# EasyEDA Pro project ProProject_myXBoxGamepad_2024-06-05.epro, schematic Schematic1_1
Create Date: 2024-04-02; Page Name: P1; Project Name: myXBoxGamepad; Schematic Name: Schematic1_1; Update Date: 2024-04-14; Company: 嘉立创EDA; Page Size: A4; Version: V1.0
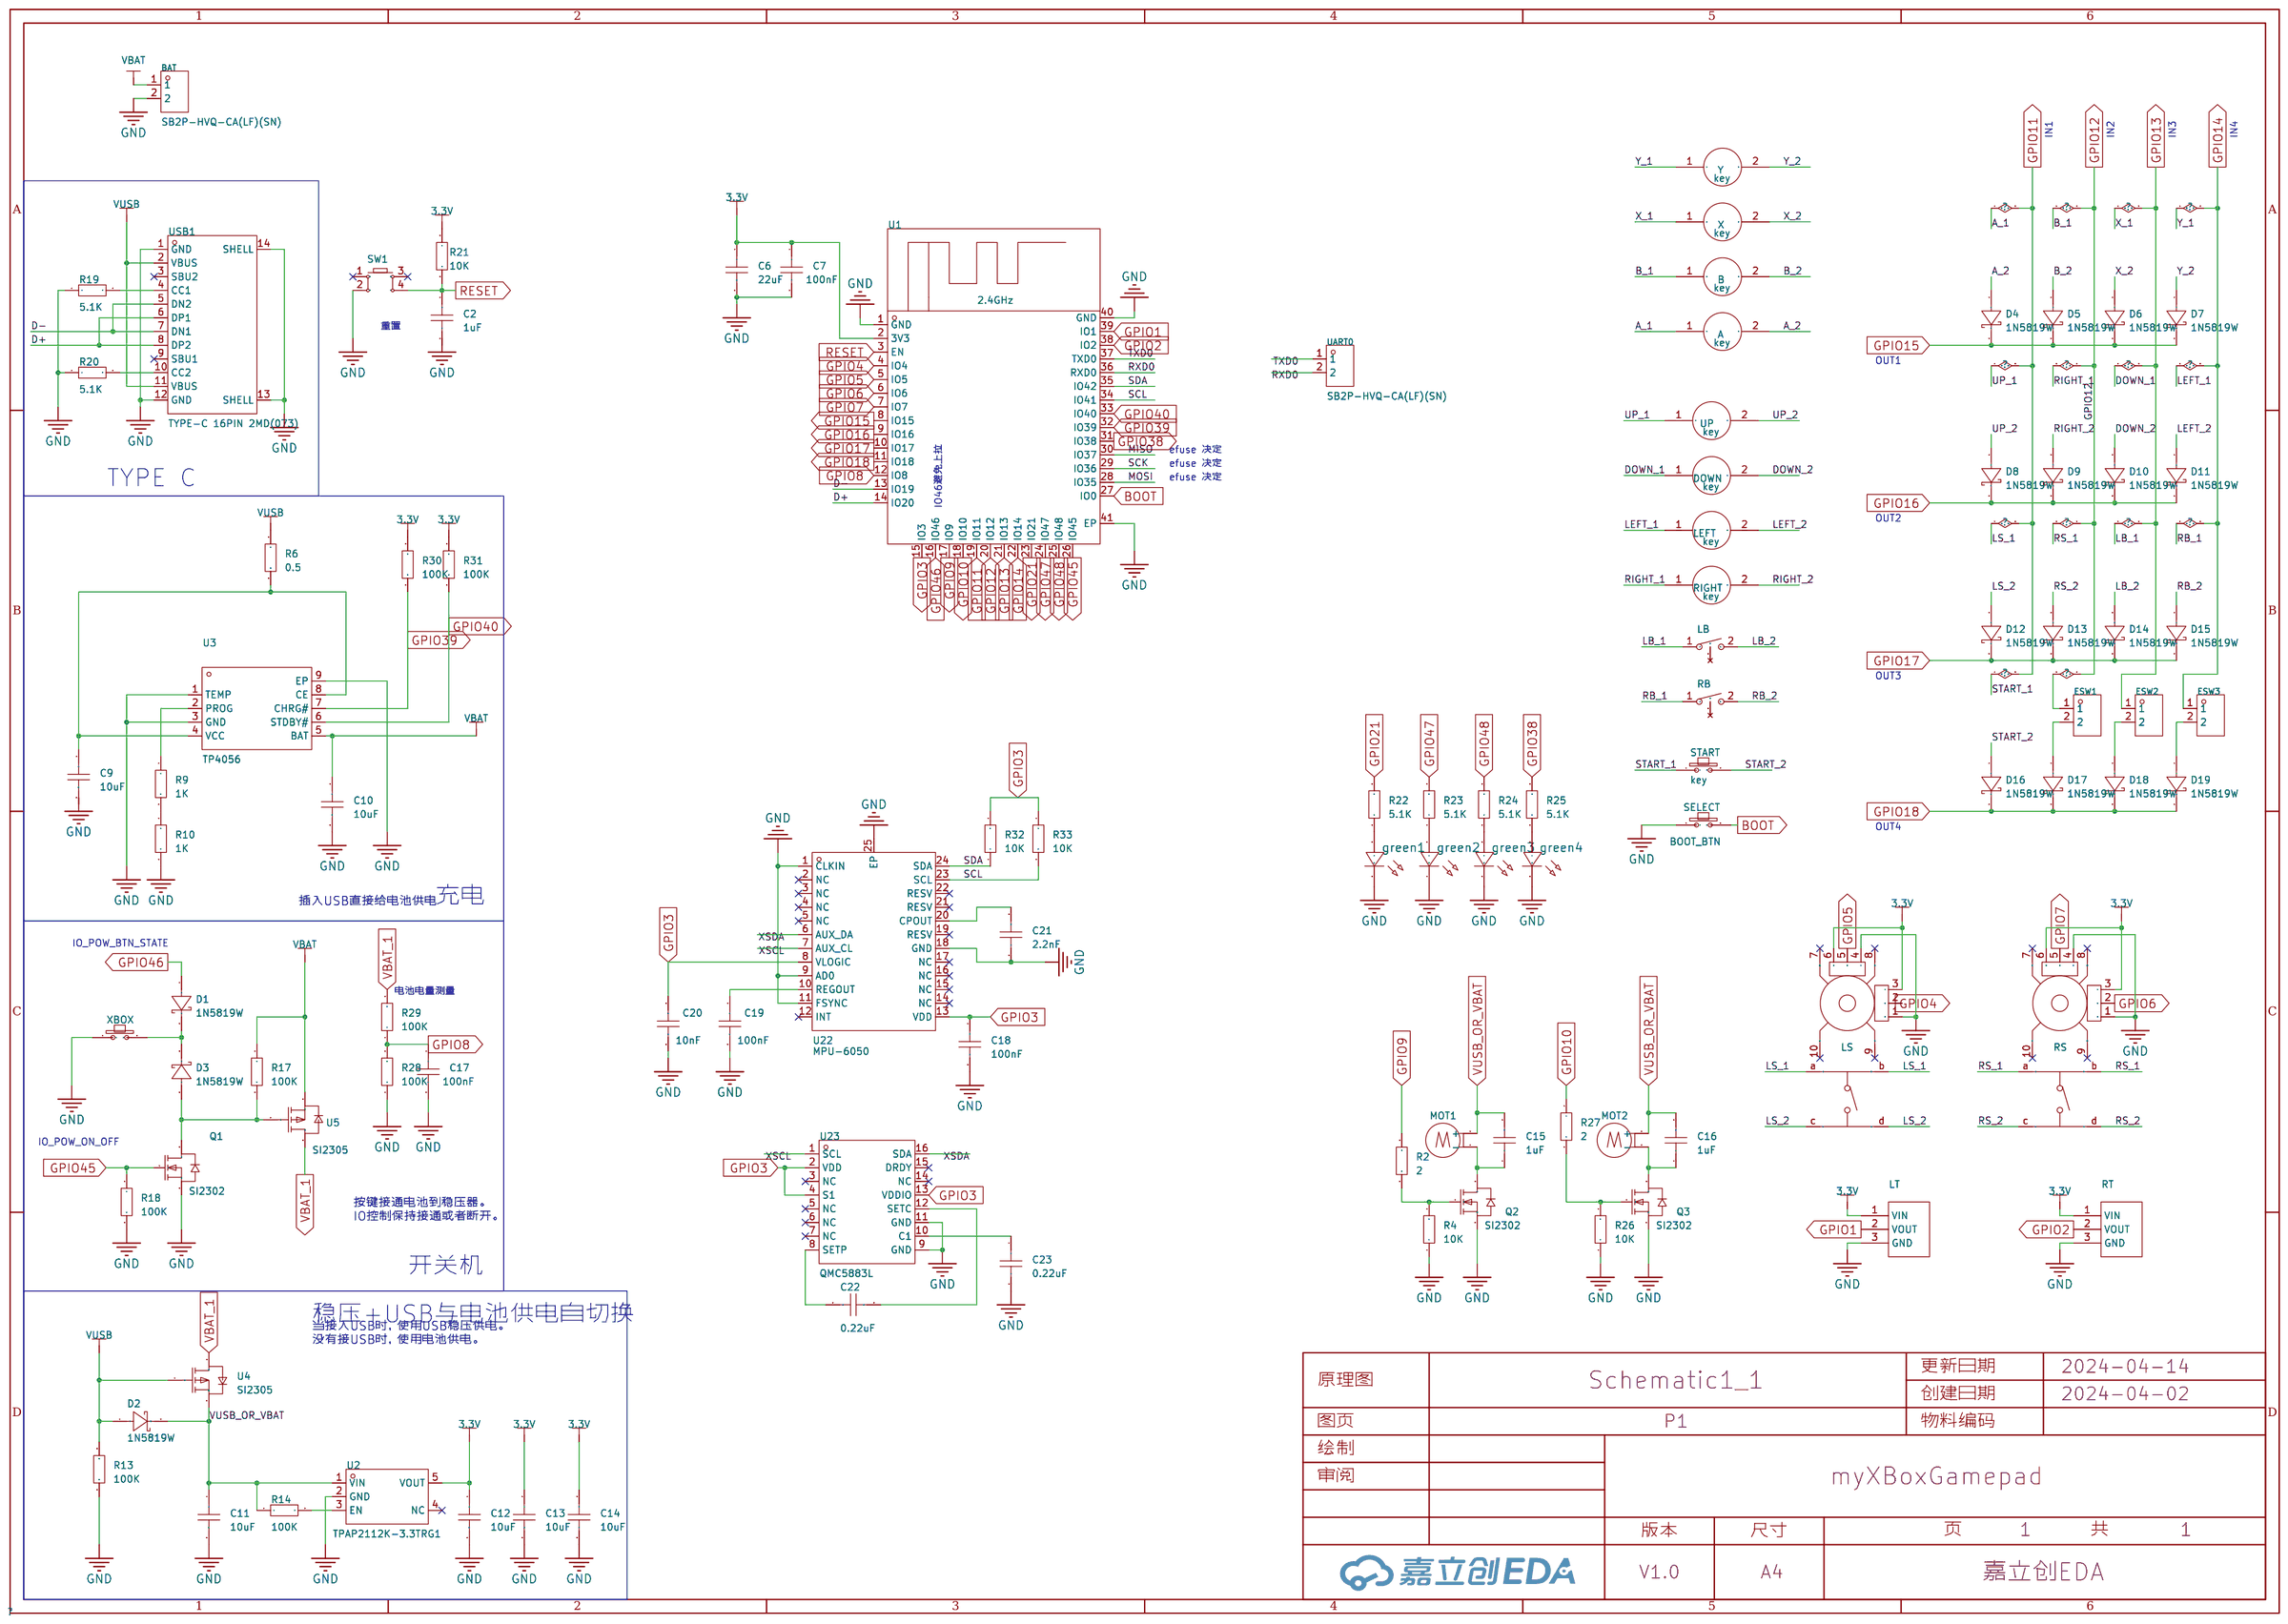
[diagram p0: schematic sheet]

## Parts
A  key  [导电硅胶按键08]
B  key  [导电硅胶按键08]
BAT  SB2P-HVQ-CA(LF)(SN)  [HDR-TH_2P-P2.54-V-M-1]
C2  1uF  [C0603]
C6  22uF  [C0805]
C7  100nF  [C0603]
C9  10uF  [C0805]
C10  10uF  [C0805]
C11  10uF  [C0805]
C12  10uF  [C0805]
C13  10uF  [C0805]
C14  10uF  [C0805]
C15  1uF  [C0603]
C16  1uF  [C0603]
C17  100nF  [C0603]
C18  100nF  [C0603]
C19  100nF  [C0603]
C20  10nF  [C0603]
C21  2.2nF  [C0603]
C22  0.22uF  [C0603]
C23  0.22uF  [C0603]
D1  1N5819W  [SOD-123_L2.7-W1.6-LS3.7-FD]
D2  1N5819W  [SOD-123_L2.7-W1.6-LS3.7-FD]
D3  1N5819W  [SOD-123_L2.7-W1.6-LS3.7-FD]
D4  1N5819W  [SOD-123_L2.7-W1.6-LS3.7-FD]
D5  1N5819W  [SOD-123_L2.7-W1.6-LS3.7-FD]
D6  1N5819W  [SOD-123_L2.7-W1.6-LS3.7-FD]
D7  1N5819W  [SOD-123_L2.7-W1.6-LS3.7-FD]
D8  1N5819W  [SOD-123_L2.7-W1.6-LS3.7-FD]
D9  1N5819W  [SOD-123_L2.7-W1.6-LS3.7-FD]
D10  1N5819W  [SOD-123_L2.7-W1.6-LS3.7-FD]
D11  1N5819W  [SOD-123_L2.7-W1.6-LS3.7-FD]
D12  1N5819W  [SOD-123_L2.7-W1.6-LS3.7-FD]
D13  1N5819W  [SOD-123_L2.7-W1.6-LS3.7-FD]
D14  1N5819W  [SOD-123_L2.7-W1.6-LS3.7-FD]
D15  1N5819W  [SOD-123_L2.7-W1.6-LS3.7-FD]
D16  1N5819W  [SOD-123_L2.7-W1.6-LS3.7-FD]
D17  1N5819W  [SOD-123_L2.7-W1.6-LS3.7-FD]
D18  1N5819W  [SOD-123_L2.7-W1.6-LS3.7-FD]
D19  1N5819W  [SOD-123_L2.7-W1.6-LS3.7-FD]
DOWN  key  [导电硅胶按键08]
ESW1  SB2P-HVQ-CA(LF)(SN)  [HDR-TH_2P-P2.54-V-M-1]
ESW2  SB2P-HVQ-CA(LF)(SN)  [HDR-TH_2P-P2.54-V-M-1]
ESW3  SB2P-HVQ-CA(LF)(SN)  [HDR-TH_2P-P2.54-V-M-1]
green1  -  [LED_0603]
green2  -  [LED_0603]
green3  -  [LED_0603]
green4  -  [LED_0603]
LB  -  [侧插式两脚开关]
LEFT  key  [导电硅胶按键08]
LS  THB001P  [SW-TH_THB001P]
LT  -  [3*2.54mm]
MOT1  -  [VIBRATING-MOTOR-SMD_WELDING]
MOT2  -  [VIBRATING-MOTOR-SMD_WELDING]
Q1  SI2302  [SOT-23-3_L2.9-W1.3-P1.90-LS2.4-BR]
Q2  SI2302  [SOT-23-3_L2.9-W1.3-P1.90-LS2.4-BR]
Q3  SI2302  [SOT-23-3_L2.9-W1.3-P1.90-LS2.4-BR]
R2  2  [R0603]
R4  10K  [R0805]
R6  0.5  [R0805]
R9  1K  [R0603]
R10  1K  [R0603]
R13  100K  [R0603]
R14  100K  [R0603]
R17  100K  [R0603]
R18  100K  [R0603]
R19  5.1K  [R0603]
R20  5.1K  [R0603]
R21  10K  [R0805]
R22  5.1K  [R0603]
R23  5.1K  [R0603]
R24  5.1K  [R0603]
R25  5.1K  [R0603]
R26  10K  [R0805]
R27  2  [R0603]
R28  100K  [R0603]
R29  100K  [R0603]
R30  100K  [R0603]
R31  100K  [R0603]
R32  10K  [R0805]
R33  10K  [R0805]
RB  -  [侧插式两脚开关]
RIGHT  key  [导电硅胶按键08]
RS  THB001P  [SW-TH_THB001P]
RT  -  [3*2.54mm]
SELECT  BOOT_BTN  [导电硅胶按键08]
START  key  [导电硅胶按键08]
SW1  -  [SW-SMD_4P-L6.0-W6.0-P4.50-LS9.0-2]
U1  2.4GHz  [WIFIM-SMD_ESP32-S3-WROOM-1-N8]
U2  TPAP2112K-3.3TRG1  [SOT-23-5_L2.9-W1.6-P0.95-LS2.8-BR]
U3  TP4056  [ESOP-8_L4.9-W3.9-P1.27-LS6.0-BL-EP]
U4  SI2305  [SOT-23-3_L2.9-W1.3-P1.90-LS2.4-BR]
U5  SI2305  [SOT-23-3_L2.9-W1.3-P1.90-LS2.4-BR]
U22  MPU-6050  [QFN-24_L4.0-W4.0-P0.50-BL-EP2.7]
U23  QMC5883L  [LGA-16_L3.0-W3.0-P0.50-BL_SQ]
UART0  SB2P-HVQ-CA(LF)(SN)  [HDR-TH_2P-P2.54-V-M-1]
UP  key  [导电硅胶按键08]
USB1  TYPE-C 16PIN 2MD(073)  [USB-C-SMD_TYPE-C-6PIN-2MD-073]
X  key  [导电硅胶按键08]
XBOX  key  [导电硅胶按键08]
Y  key  [导电硅胶按键08]

## Library data of the parts
A B DOWN LEFT RIGHT SELECT START UP X XBOX Y = 导电硅胶按键01
BAT ESW1-ESW3 UART0 = SB2P-HVQ-CA(LF)(SN): 插针结构:1x2P;间距:2.5mm;行距:-;圆针/方针:-;安装类型:直插;排数:单排;总PIN位数:2P;额定电流:-;额定电压:-;配合针长度:7.5mm;塑高:3.3mm;端接针长度:3.4mm;触头材质:黄铜;触头镀层:-;工作温度范围:-25℃~+85℃;颜色:白色;; LCSC Part Name: 间距:2.5mm 1x2P 直插; Supplier Part: C157909; Manufacturer: JST; Supplier Footprint: 插件,P=2.5mm; JLCPCB Part Class: 扩展库; Datasheet: https://atta.szlcsc.com/upload/public/pdf/source/20180319/2518302FDF705D922213CC841EAA9FB0.pdf; Supplier: LCSC; Pin Structure: 1x2P; Pitch: 2.5mm; Mounting Type: 直插; Number of Rows: 单排; Number of Pins: 2P; Length of Mating Pin: 7.5mm; Insulation Height: 3.3mm; Length of End Connection Pin: 3.4mm; Contact Material: 黄铜; Operating Temperature Range: -25℃~+85℃; Color: 白色
C2 C7 C15-C23 = CAP_0603: Supplier Footprint: 0603
C6 = CL21A226MAQNNNE: 容值:22uF;精度:±20%;额定电压:25V;材质(温度系数):X5R;; LCSC Part Name: 22uF ±20% 25V; Supplier Part: C45783; Manufacturer: SAMSUNG(三星); Supplier Footprint: 0805; JLCPCB Part Class: Basic Part; Datasheet: https://atta.szlcsc.com/upload/public/pdf/source/20160218/1457707763339.pdf; Supplier: LCSC; Tolerance: ±20%; Voltage Rated: 25V; Temperature Coefficient: X5R
C9-C14 = CL21B106KAYQNNE: 容值:10uF;精度:±10%;额定电压:25V;材质(温度系数):X7R;; LCSC Part Name: 10uF ±10% 25V; Supplier Part: C3039694; Manufacturer: SAMSUNG(三星); Supplier Footprint: 0805; JLCPCB Part Class: Extended Part; Datasheet: https://atta.szlcsc.com/upload/public/pdf/source/20220622/FE4D058064E48FAA8DE812CA870A4102.pdf; Supplier: LCSC; Tolerance: ±10%; Voltage Rated: 25V; Temperature Coefficient: X7R
D1-D19 = 1N5819W_C5451628: 二极管配置:独立式;正向压降(Vf):600mV@200mA;直流反向耐压(Vr):40V;平均整流电流(Io):350mA;; LCSC Part Name: 电压:40V 电流:350mA; Supplier Part: C5451628; Manufacturer: HXY MOSFET(华轩阳电子); Supplier Footprint: SOD-123; JLCPCB Part Class: Extended Part; Datasheet: https://atta.szlcsc.com/upload/public/pdf/source/20230718/8CE4C7F16758863028CFFFD6944BDCD1.pdf; Supplier: LCSC; Diode Configuration: 独立式; Forward Voltage (Vf@If): 600mV@200mA; Reverse Voltage (Vr): 40V; Average Rectified Current (Io): 350mA; Reverse Leakage Current (Ir): 5uA@30V; Peak forward surge current: 2A
green1-green4 = LED_0603-R: Supplier Footprint: 0603
LB RB = 直插式侧边按键: LCSC Part Name: 轻触开关3*6*5.0mm带铜支架侧按侧插250gf; Supplier Part: C493000; Manufacturer: Yuandi(元迪); Manufacturer Part: TS-1096-A2B3-D2; JLCPCB Part Class: Extended Part; Datasheet: https://atta.szlcsc.com/upload/public/pdf/source/20200316/C492993_8DFEBA580857F173983E408356080438.pdf; Supplier: LCSC; Circuit: 单刀单掷; Actuator Style: 矩形按钮; Operating Force: 250gf@±30gf
LS RS = THB001P: 带有多功能, 高质量的双轴杠杆和集成的中心选择开关 适用于航模玩具遥控器电位器、3D摇杆PS4手柄游戏机、无人机摇杆电位器、工业控制器; LCSC Part Name: 微型指拨摇杆开关; Supplier Part: C2685355; Manufacturer: C&K; Supplier Footprint: 插件-14P,17x21mm; JLCPCB Part Class: 扩展库; Datasheet: https://atta.szlcsc.com/upload/public/pdf/source/20210114/C2685355_98E98C84804317E8B305B6FAD3A93D12.pdf; Supplier: LCSC
LT RT = 电位计: 20kΩ
MOT1 MOT2 = motor
Q1-Q3 = SI2302-HXY: 类型:N沟道;漏源电压(Vdss):20V;连续漏极电流(Id):2.8A;功率(Pd):900mW;导通电阻(RDS(on)@Vgs,Id):55mΩ@4.5V,2.8A;阈值电压(Vgs(th)@Id):1.2V@250uA;; LCSC Part Name: N沟道 耐压:20V 电流:2.8A; Supplier Part: C4748714; Manufacturer: HXY MOSFET(华轩阳电子); Supplier Footprint: SOT-23; JLCPCB Part Class: 扩展库; Datasheet: https://atta.szlcsc.com/upload/public/pdf/source/20220720/B2EC63D46AD65363D9D3692163B46869.pdf; Supplier: LCSC; Type: N沟道; Drain Source Voltage (Vdss): 20V; Continuous Drain Current (Id): 2.8A; Power Dissipation (Pd): 900mW; Drain Source On Resistance (RDS(on)@Vgs,Id): 55mΩ@4.5V,2.8A; Gate Threshold Voltage (Vgs(th)@Id): 1.2V@250uA; Input Capacitance (Ciss@Vds): 260pF@10V
R2 R6 R9 R10 R13 R14 R17-R20 R22-R25 R27-R31 = Res_0603: Supplier Footprint: 0603
R4 R21 R26 R32 R33 = Res_0805: Supplier Footprint: 0805
SW1 = Key_SMD_6x6x6.5: Supplier Footprint: SMD
U1 = ESP32-S3-WROOM-1-N8: 核心处理器:ESP32-S3芯片;频率:2.4GHz;; LCSC Part Name: 通用型Wi-Fi+低功耗蓝牙MCU模组; Supplier Part: C2913198; Manufacturer: ESPRESSIF(乐鑫); Supplier Footprint: SMD,18x25.5mm; JLCPCB Part Class: 扩展库; Datasheet: https://atta.szlcsc.com/upload/public/pdf/source/20221026/9A44C6421221D672346AAE72DF9F8146.pdf; Supplier: LCSC; Core Processor: ESP32-S3芯片; Support Interface: I2C；GPIO；SPI；PWM；ADC；UART；USB；I2S
U2 = TPAP2112K-3.3TRG1: LCSC Part Name: Higt PSRR Voltage Regulator; Supplier Part: C3021085; Manufacturer: TECH PUBLIC(台舟); Supplier Footprint: SOT-23-5; JLCPCB Part Class: 扩展库; Datasheet: https://atta.szlcsc.com/upload/public/pdf/source/20220524/8CF0233C3A5BEC2862946B9116FD2D75.pdf; Supplier: LCSC
U3 = TP4056_C725790: Supplier Part: C725790; Manufacturer: UMW(友台半导体); Supplier Footprint: ESOP-8; JLCPCB Part Class: 扩展库; Datasheet: https://atta.szlcsc.com/upload/public/pdf/source/20231109/CF74897CE79A500F7FE27A45ADCCC631.pdf; Supplier: LCSC
U4 U5 = SI2305: 类型:P沟道;漏源电压(Vdss):12V;连续漏极电流(Id):4.1A;功率(Pd):1.3W;导通电阻(RDS(on)@Vgs,Id):90mΩ@1.8V,2A;阈值电压(Vgs(th)@Id):1V@250uA;; LCSC Part Name: P沟道 耐压:12V 电流:4.1A; Supplier Part: C5248046; Manufacturer: GOODWORK(固得沃克); Supplier Footprint: SOT-23; JLCPCB Part Class: 扩展库; Datasheet: https://atta.szlcsc.com/upload/public/pdf/source/20221108/4BEB1330C0DF58195C97AD56AE793A1E.pdf; Supplier: LCSC; Type: P沟道; Drain Source Voltage (Vdss): 12V; Continuous Drain Current (Id): 4.1A; Power Dissipation (Pd): 1.3W; Drain Source On Resistance (RDS(on)@Vgs,Id): 90mΩ@1.8V,2A; Gate Threshold Voltage (Vgs(th)@Id): 1V@250uA
U22 = MPU-6050: 传感器类型:加速度计陀螺仪;; Supplier Part: C24112; Manufacturer: TDK InvenSense(应美盛); Supplier Footprint: QFN-24-EP(4x4); JLCPCB Part Class: 扩展库; Datasheet: https://atta.szlcsc.com/upload/public/pdf/source/20140425/1457707046159.pdf; Supplier: LCSC; Sensor Type: 加速度计陀螺仪; Operating Temperature: -40℃~+85℃
U23 = QMC5883L: LCSC Part Name: 三轴磁传感器; Supplier Part: C976032; Manufacturer: QST(上海矽睿); Supplier Footprint: LGA-16(3x3x0.9); JLCPCB Part Class: Extended Part; Datasheet: https://atta.szlcsc.com/upload/public/pdf/source/20201217/C976032_5B9A2F3901E175046CBA037B1F18A1F2.pdf; Supplier: LCSC
USB1 = TYPE-C 16PIN 2MD(073): 连接器类型:Type-C;标准:-;公母:母;端口数量:1;触点数量:16P;安装方式:卧贴;额定电流 - 电源:5A;工作温度范围:-25℃~+85℃;; LCSC Part Name: Type-C 母 卧贴; Supplier Part: C2765186; Manufacturer: SHOU HAN(首韩); Supplier Footprint: SMD; JLCPCB Part Class: 扩展库; Datasheet: https://atta.szlcsc.com/upload/public/pdf/source/20211123/39B17C16241EAC15C5E277BDA434118E.pdf; Supplier: LCSC; Connector Type: Type-C; Gender: 母; Number of Ports: 1; Number of Contacts: 16P; Mounting Style: 卧贴; Current Rating - Power (Max): 5A; Operating Temperature Range: -25℃~+85℃

## Nets
3.3V: C6.1 C7.1 C12.1 C13.1 C14.1 LS.3(A) LS.6(B) LT.1(VIN) R21.1 R30.2 R31.2 RS.3(A) RS.6(B) RT.1(VIN) U1.2(3V3) U2.5(VOUT)
GND: BAT.2 C2.2 C6.2 C7.2 C9.2 C10.2 C11.2 C12.2 C13.2 C14.2 C17.2 C18.2 C19.2 C20.2 C21.1 C23.2 green1.1(C) green2.1(C) green3.1(C) green4.1(C) LS.1(B) LS.4(A) LT.3(GND) Q1.2(S) Q2.2(S) Q3.2(S) R4.1 R10.2 R13.1 R18.2 R19.1 R20.1 R26.1 R28.1 RS.1(B) RS.4(A) RT.3(GND) SELECT.1 SW1.2 U1.1(GND) U1.40(GND) U1.41(EP) U2.2(GND) U3.1(TEMP) U3.3(GND) U3.9(EP) U22.1(CLKIN) U22.9(AD0) U22.11(FSYNC) U22.18(GND) U22.25(EP) U23.9(GND) U23.11(GND) USB1.1(GND) USB1.12(GND) USB1.13(SHELL) USB1.14(SHELL) XBOX.1
VBAT: BAT.1 C10.1 R17.1 U3.5(BAT) U5.2(S)
VBAT_1: R29.2 U4.3(D) U5.3(D)
A_1: A.1 LS.a LS.b START.1 U1.19(IO11) UP.1
A_2: A.2 D4.1(A)
B_1: B.1 ESW1.1 RIGHT.1 RS.a RS.b U1.20(IO12)
B_2: B.2 D5.1(A)
BOOT: SELECT.2 U1.27(IO0)
D+: U1.14(IO20) USB1.6(DP1) USB1.8(DP2)
D-: U1.13(IO19) USB1.5(DN2) USB1.7(DN1)
DOWN_1: DOWN.1 ESW2.1 LB.1 U1.21(IO13) X.1
DOWN_2: D10.1(A) DOWN.2
GPIO1: LT.2(VOUT) U1.39(IO1)
GPIO2: RT.2(VOUT) U1.38(IO2)
GPIO3: C18.1 C20.1 R32.2 R33.1 U1.15(IO3) U22.8(VLOGIC) U22.13(VDD) U23.2(VDD) U23.4(S1) U23.13(VDDIO)
GPIO4: LS.2(DTA) U1.4(IO4)
GPIO5: LS.5(DTA) U1.5(IO5)
GPIO6: RS.2(DTA) U1.6(IO6)
GPIO7: RS.5(DTA) U1.7(IO7)
GPIO8: C17.1 R28.2 R29.1 U1.12(IO8)
GPIO9: R2.2 U1.17(IO9)
GPIO10: R27.1 U1.18(IO10)
GPIO14: ESW3.1 LEFT.1 RB.1 U1.22(IO14) Y.1
GPIO15: D4.2(C) D5.2(C) D6.2(C) D7.2(C) U1.8(IO15)
GPIO16: D8.2(C) D9.2(C) D10.2(C) D11.2(C) U1.9(IO16)
GPIO17: D12.2(C) D13.2(C) D14.2(C) D15.2(C) U1.10(IO17)
GPIO18: D16.2(C) D17.2(C) D18.2(C) D19.2(C) U1.11(IO18)
GPIO21: R22.2 U1.23(IO21)
GPIO38: R25.2 U1.31(IO38)
GPIO39: R30.1 U1.32(IO39) U3.7(CHRG#)
GPIO40: R31.1 U1.33(IO40) U3.6(STDBY#)
GPIO45: Q1.1(G) R18.1 U1.26(IO45)
GPIO46: D1.1(A) U1.16(IO46)
GPIO47: R23.2 U1.24(IO47)
GPIO48: R24.2 U1.25(IO48)
LB_2: D14.1(A) LB.2
LEFT_2: D11.1(A) LEFT.2
LS_2: D12.1(A) LS.c LS.d
MISO: U1.30(IO37)
MOSI: U1.28(IO35)
RB_2: D15.1(A) RB.2
RESET: C2.1 R21.2 SW1.4 U1.3(EN)
RIGHT_2: D9.1(A) RIGHT.2
RS_2: D13.1(A) RS.c RS.d
RXD0: U1.36(RXD0) UART0.2
SCK: U1.29(IO36)
SCL: R33.2 U1.34(IO41) U22.23(SCL)
SDA: R32.1 U1.35(IO42) U22.24(SDA)
START_2: D16.1(A) START.2
TXD0: U1.37(TXD0) UART0.1
UP_2: D8.1(A) UP.2
VUSB: D2.1(A) R6.1 R13.2 U4.1(G) USB1.2(VBUS) USB1.11(VBUS)
VUSB_OR_VBAT: C11.1 C15.2 C16.2 D2.2(C) MOT1.2(+) MOT2.2(+) R14.1 U2.1(VIN) U4.2(S)
X_2: D6.1(A) X.2
XSCL: U22.7(AUX_CL) U23.1(SCL)
XSDA: U22.6(AUX_DA) U23.16(SDA)
Y_2: D7.1(A) Y.2
$1N1324: R9.2 R10.1
$1N1328: R9.1 U3.2(PROG)
$1N2751: R14.2 U2.3(EN)
$1N3780: D3.1(A) Q1.3(D) R17.2 U5.1(G)
$1N3912: D1.2(C) D3.2(C) XBOX.2
$1N8434: R19.2 USB1.4(CC1)
$1N8460: R20.2 USB1.10(CC2)
$1N17335: green1.2(A) R22.1
$1N17361: green2.2(A) R23.1
$1N17387: green3.2(A) R24.1
$1N17413: green4.2(A) R25.1
$1N18714: C15.1 MOT1.1(-) Q2.3(D)
$1N18779: Q2.1(G) R2.1 R4.2
$1N18990: C16.1 MOT2.1(-) Q3.3(D)
$1N18998: Q3.1(G) R26.2 R27.2
$1N25608: D17.1(A) ESW1.2
$1N25630: D18.1(A) ESW2.2
$1N25649: D19.1(A) ESW3.2
$1N28110: C9.1 R6.2 U3.4(VCC) U3.8(CE)
$1N35263: C19.1 U22.10(REGOUT)
$1N35470: C21.2 U22.20(CPOUT)
$1N35689: C22.1 U23.8(SETP)
$1N35693: C22.2 U23.12(SETC)
$1N35727: C23.1 U23.10(C1)

Not connected (* = marked no-connect by the designer): LB NC; LS 7(GND)* 8(GND)* 9(GND)* 10(GND)*; RB NC; RS 7(GND)* 8(GND)* 9(GND)* 10(GND)*; SW1 1* 3*; U2 4(NC)*; U22 2(NC)* 3(NC)* 4(NC)* 5(NC)* 12(INT)* 14(NC)* 15(NC)* 16(NC)* 17(NC)* 19(RESV)* 21(RESV)* 22(RESV)*; U23 3(NC)* 5(NC)* 6(NC)* 7(NC)* 14(NC)* 15(DRDY)*; USB1 3(SBU2)* 9(SBU1)*

## Notes on the sheet
- IN1
- IN2
- IN3
- IN4
- 重置
- OUT1
- efuse 决定
- efuse 决定
- efuse 决定
- TYPE C
- IO46避免上拉
- OUT2
- OUT3
- OUT4
- 插入USB直接给电池供电
- 充电
- IO_POW_BTN_STATE
- 电池电量测量
- IO_POW_ON_OFF
- 按键接通电池到稳压器。
  IO控制保持接通或者断开。
- 开关机
- 稳压+USB与电池供电自切换
- 当接入USB时，使用USB稳压供电。
  没有接USB时，使用电池供电。
